# Altium schematic sheet power_supply.SchDoc
size Letter; Author: Ye-Sheng Kuo; Organization: Altium Limited; Address1: L3, 12a Rodborough Rd; Address2: Frenchs Forest; Address3: NSW; Address4: Australia 2086; Revision: 1
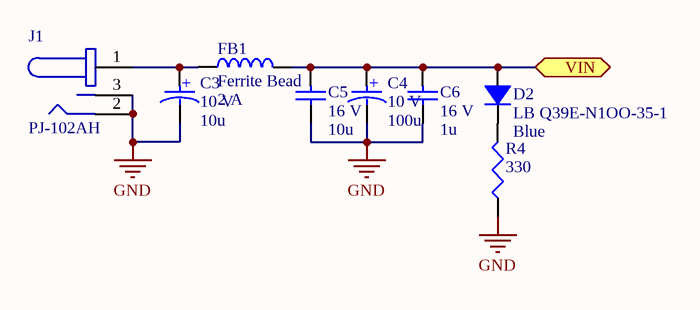
[diagram p0: power_supply.SchDoc]

## Parts
C3  value 10u  voltage rated: 10 V  [0603 - Polar Marking]  (hidden comment: Tantalum capacitor)
C4  value 100u  voltage rated: 10 V  [2917]  (hidden comment: Ceramic capacitor)
C5  value 10u  voltage rated: 16 V  [0603]  (hidden comment: Ceramic capacitor)
C6  value 1u  voltage rated: 16 V  [0603]  (hidden comment: Ceramic capacitor)
D2  LB Q39E-N1OO-35-1  Color: Blue  [0603 - LED]
FB1  Ferrite Bead  current rating: 2 A  [0603]
J1  PJ-102AH  [PJ-102AH]
R4  value 330  [0603]  (hidden comment: Chip resistor)

## Ports
VIN

## Nets
GND: C3.2 C4.2 C5.2 C6.2 J1.2 J1.3 R4.2
VIN: C4.1 C5.1 C6.1 D2.1 FB1.1 ; port VIN
NetC3_1: C3.1 FB1.2 J1.1
NetD2_2: D2.2 R4.1

## Notes on the sheet
- Title
- Date:
- Author:
- Revision:
- Sheet
- of
- University of Michigan
- File:
- (in symbol C_10u_10V_0603_tantalum) +
- (in symbol C_100u_10V_2917_tantalum) +

## Library data of the parts
C3 = C_10u_10V_0603_tantalum: Tantalum capacitor, 10 uF, 10 V, 0603 package; Manufacture: Rohm Semiconductor; tolerance: 10%; ESR: 9 Ω; package: 0603; Supplier 1: Digi-Key; Supplier Part Number 1: 511-1679-1-ND
C4 = C_100u_10V_2917_tantalum: Tantalum capacitor, 100u, 2917 package; Manufacture: Kemet; tolerance: 10%; package: 2917; Supplier 1: Digi-Key; Supplier Part Number 1: 399-3769-1-ND
C5 = C_10u_16V_0603_ceramic: Ceramic capacitor, 10 uF, 16 V, 0603 package; Manufacture: TDK; tolerance: 20%; Temperature Coefficient: X5R; package: 0603; Supplier 1: Digi-Key; Supplier Part Number 1: 445-9065-1-ND
C6 = C_1u_16V_0603_ceramic: Ceramic capacitor, 1 uF, 16 V, 0603 package; Manufacture: TDK; tolerance: 10%; package: 0603; Supplier 1: Digi-Key; Supplier Part Number 1: 445-1604-1-ND
D2 = D_LED_Blue_0603: LED, Blue, 0603; package: 0603; Supplier 1: Digi-Key; Supplier Part Number 1: 475-2815-1-ND
FB1 = FB_2A_0603: Ferrite Bead, 2 A, 0603 package; DC resistance: 50 m; package: 0603; Supplier 1: Digi-Key; Supplier Part Number 1: 553-2387-1-ND
J1 = PJ-102AH: CONN PWR JACK 2.1X5.5MM HIGH CUR; Supplier 1: Digi-Key; Supplier Part Number 1: CP-102AH-ND
R4 = R_330_0603: Chip resistor, 330, 0603 package; tolerance: 1%; power: 1/10 W; package: 0603; Supplier 1: Digi-Key; Supplier Part Number 1: 541-330HCT-ND